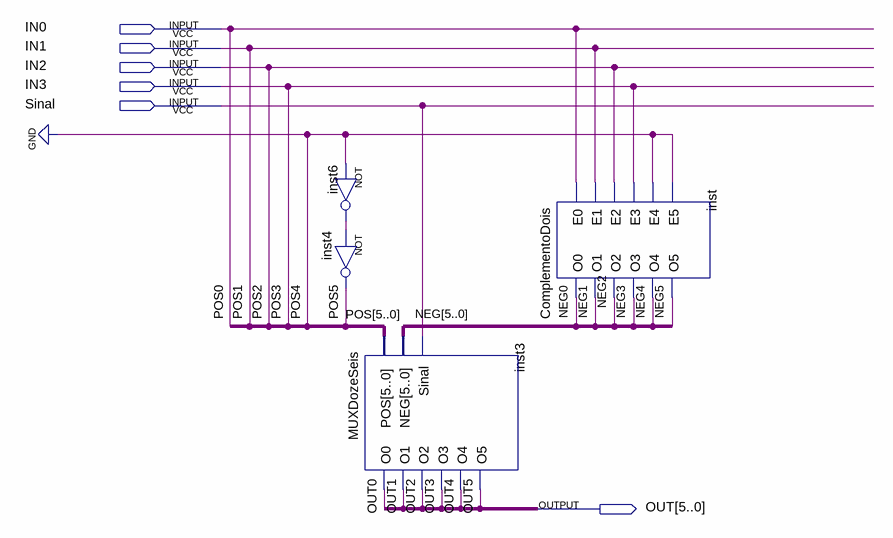
[diagram p0: schematic sheet]
// Quartus schematic Conversor5bitspara6bits.bdf as structural Verilog: 4 symbols, 6 pins
module Conversor5bitspara6bits (
  input  IN0,
  input  IN1,
  input  IN2,
  input  IN3,
  input  Sinal,
  output [5:0] OUT
);

  wire inst6_out;
  wire [5:0] NEG;
  wire [5:5] POS;

  not inst6 (inst6_out, 1'b0);
  not inst4 (POS[5], inst6_out);
  MUXDozeSeis inst3 (
    .POS({POS[5], 1'b0, IN3, IN2, IN1, IN0}), .NEG(NEG), .Sinal(Sinal), .O0(OUT[0]), .O1(OUT[1]),
    .O2(OUT[2]), .O3(OUT[3]), .O4(OUT[4]), .O5(OUT[5]));
  ComplementoDois inst (
    .E0(IN0), .E1(IN1), .E2(IN2), .E3(IN3), .E4(1'b0), .E5(1'b0), .O0(NEG[0]), .O1(NEG[1]), .O2(NEG[2]),
    .O3(NEG[3]), .O4(NEG[4]), .O5(NEG[5]));

  // Other names for the same wires on the sheet: POS[3:0] = {IN3, IN2, IN1, IN0}; POS0 = IN0; POS1 = IN1; POS2 = IN2;
  //   POS3 = IN3
endmodule
